# EasyEDA Pro project ProPrj_门禁卡管理系统_2024-12-31.epro

# Schematic Schematic1
Create Date: 2024-09-03; Page Name: P1; Project Name: 门禁卡管理系统; Schematic Name: Schematic1; Update Date: 2024-09-03; Company: 嘉立创EDA; Page Size: A4; Version: V1.0
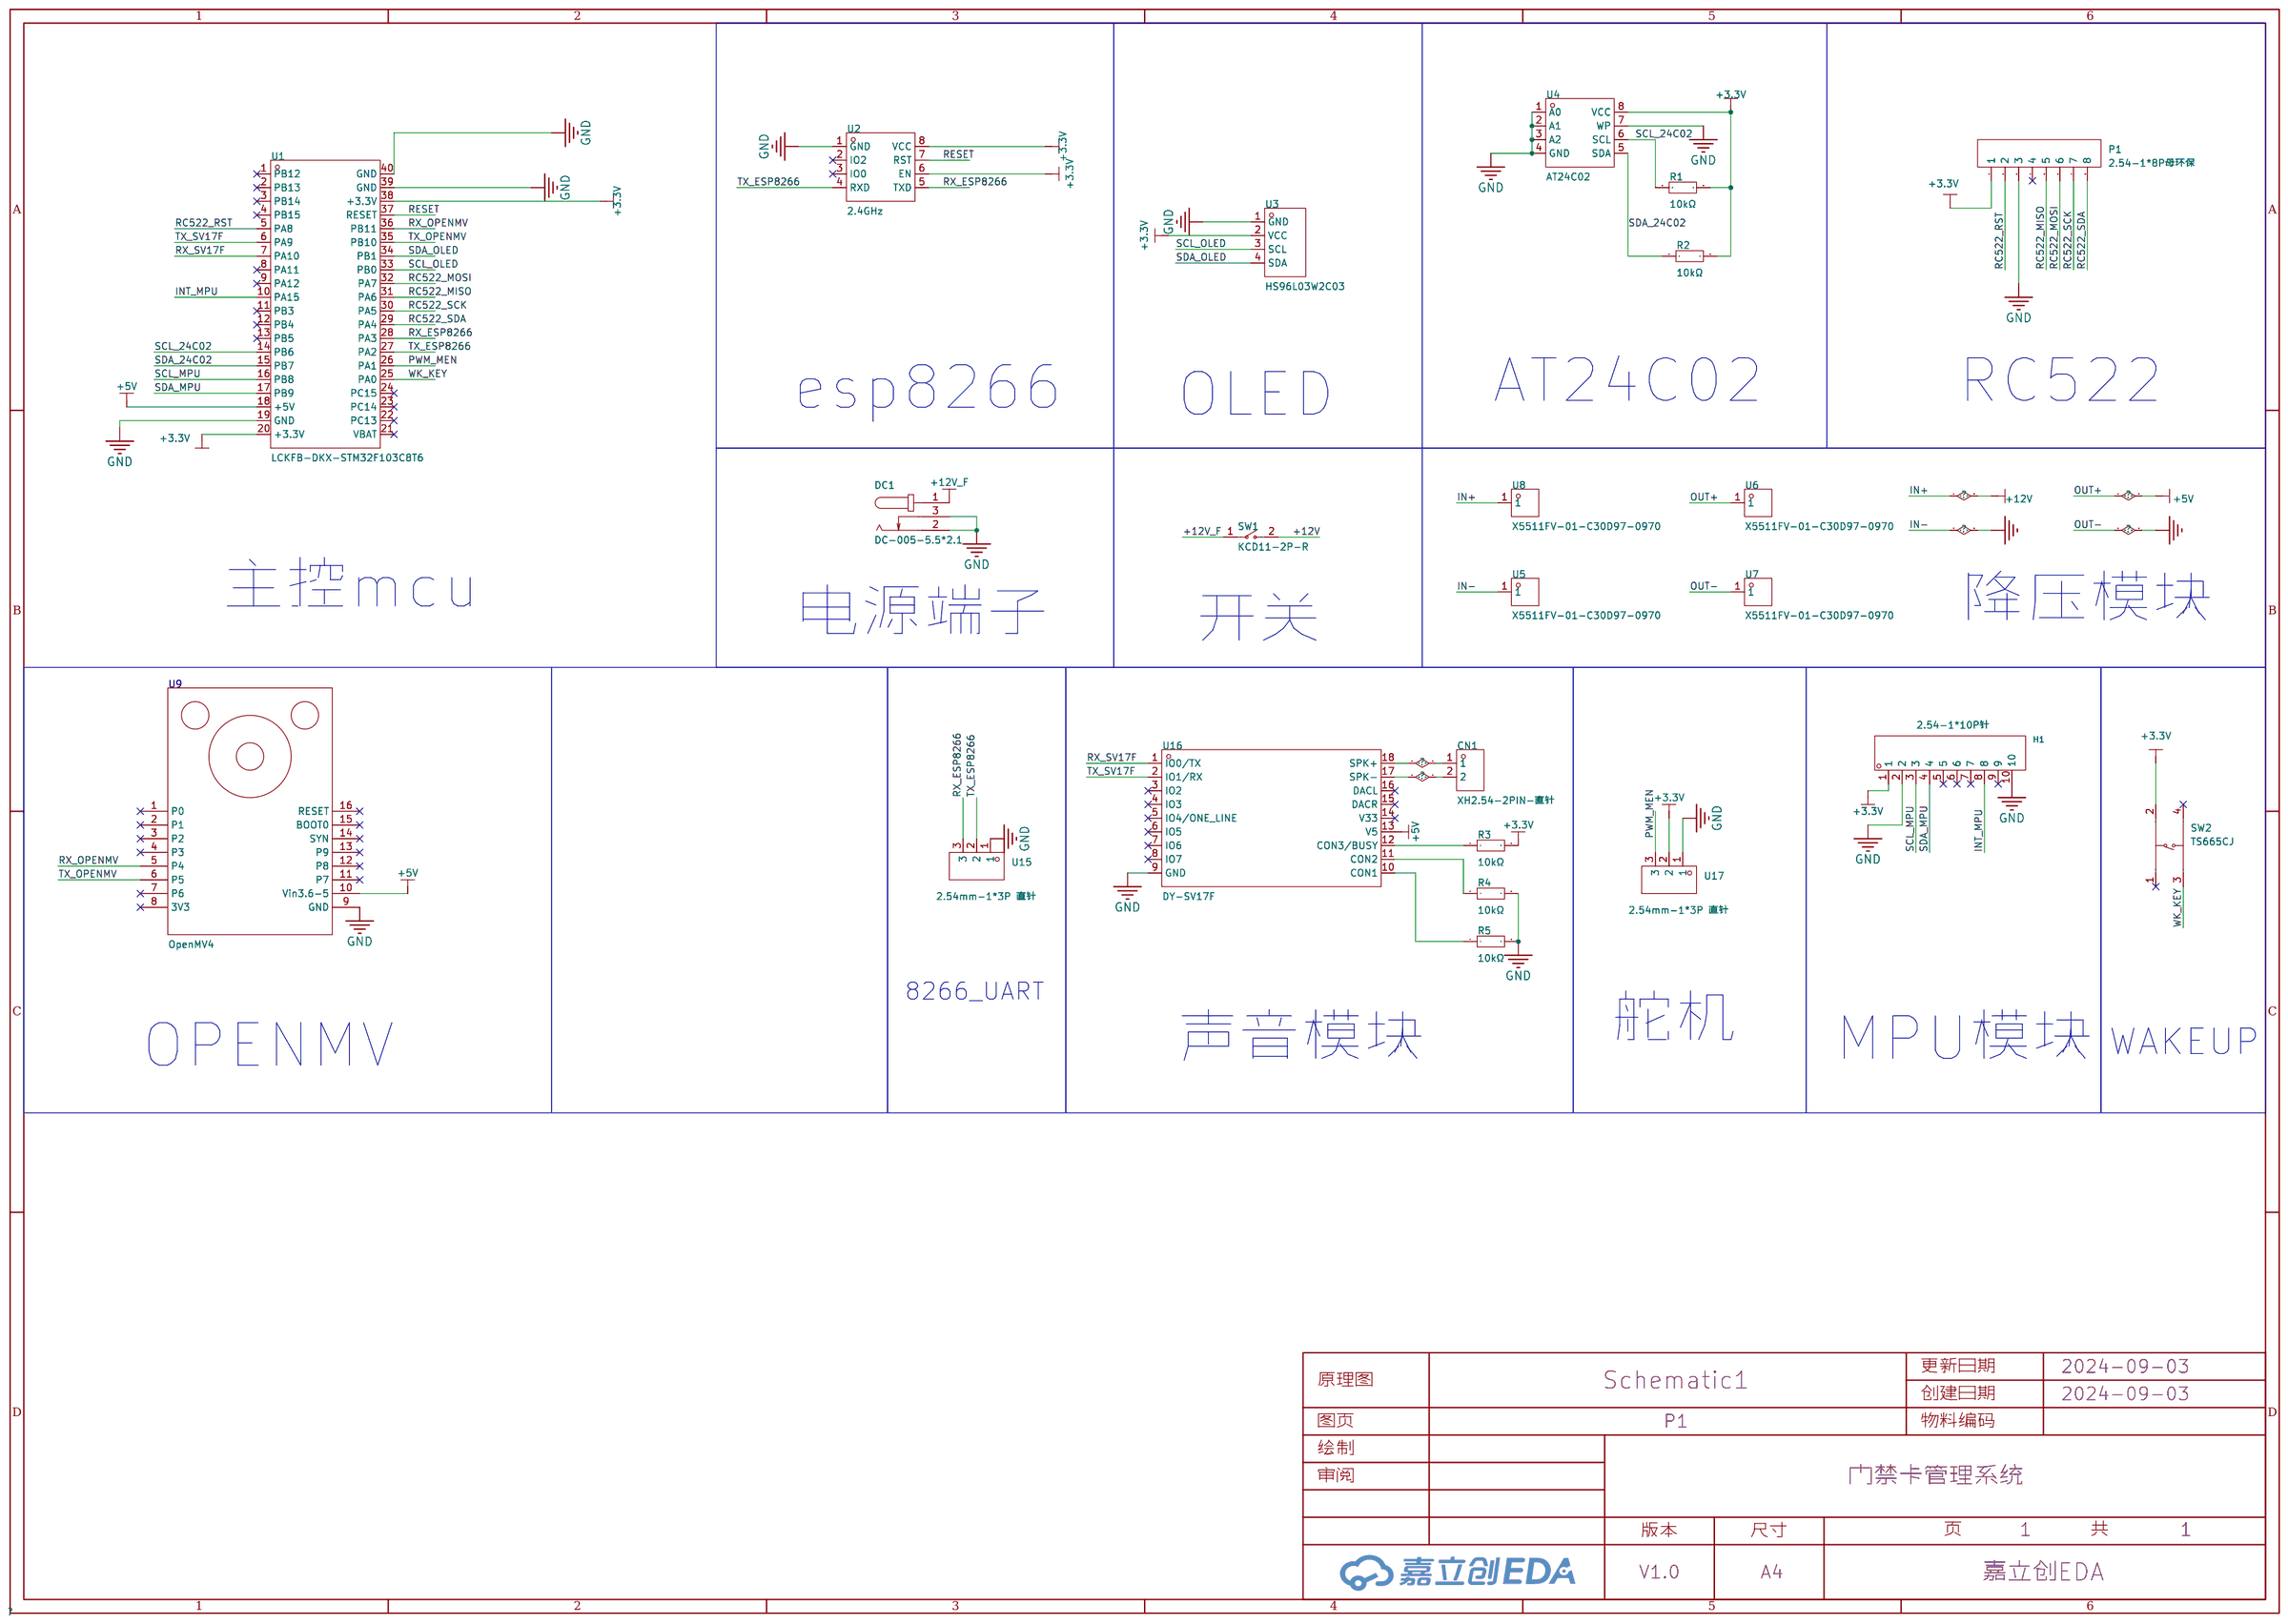
[diagram p0: schematic sheet]

## Parts
CN1  XH2.54-2PIN-直针  [CONN-TH_XH2.54-2P]
DC1  DC-005-5.5*2.1  [DC-IN-TH_DC-005-2]
H1  2.54-1*10P针  [HDR-TH_10P-P2.54-V-M-1]
P1  2.54-1*8P母环保  [HDR-TH_8P-P2.54-V-F-1]
R1  10kΩ  [R0805]
R2  10kΩ  [R0805]
R3  10kΩ  [R0805]
R4  10kΩ  [R0805]
R5  10kΩ  [R0805]
SW1  KCD11-2P-R  [SW-TH_2P-L15.0-W10.5-P5.00_KCD11-2P-R]
SW2  TS665CJ  [SW-TH_4P-L6.0-W6.0-P4.50-LS6.5]
U1  LCKFB-DKX-STM32F103C8T6  [CONN-TH_L53.3-W22.9_STM32F103C8T6-CARD]
U2  2.4GHz  [WIFIM-TH_8P-L24.7-W14.4-P2.54]
U3  HS96L03W2C03  [OLED-TH_L27.8-W27.2-P2.54_C9900033791]
U4  AT24C02  [SOP-8_L5.0-W4.0-P1.27-LS6.0-BL]
U5  X5511FV-01-C30D97-0970  [HDR-TH_1P-V-F-1]
U6  X5511FV-01-C30D97-0970  [HDR-TH_1P-V-F-1]
U7  X5511FV-01-C30D97-0970  [HDR-TH_1P-V-F-1]
U8  X5511FV-01-C30D97-0970  [HDR-TH_1P-V-F-1]
U9  OpenMV4  [OPENMV4]
U15  2.54mm-1*3P 直针  [HDR-TH_3P-P2.54-V-M-1]
U16  DY-SV17F  [COMM-SMD_DY-SV17F]
U17  2.54mm-1*3P 直针  [HDR-TH_3P-P2.54-V-M-1]

## Library data of the parts
CN1 = XH2.54-2PIN-直针: Supplier Part: C9900011425; Supplier Footprint: XH2.54-2PIN; JLCPCB Part Class: 扩展库; Supplier: LCSC
DC1 = DC-005-5.5*2.1: Supplier Part: C9900017044; Supplier Footprint: DC-005; JLCPCB Part Class: 扩展库; Supplier: LCSC
H1 = 2.54-1*10P针: 插针结构:1x10P;间距:2.54mm;行距:-;圆针/方针:方针;安装类型:直插;排数:单排;总PIN位数:10P;额定电流:3A;额定电压:-;配合针长度:-;塑高:-;端接针长度:-;触头材质:-;触头镀层:-;工作温度范围:-40℃~+105℃;颜色:黑色;; LCSC Part Name: 间距:2.54mm 1x10P 直插 方针; Supplier Part: C57369; Manufacturer: BOOMELE(博穆精密); Supplier Footprint: 插件,P=2.54mm; JLCPCB Part Class: 扩展库; Datasheet: https://atta.szlcsc.com/upload/public/pdf/source/20151109/1457707572883.pdf; Supplier: LCSC; Pin Structure: 1x10P; Pitch: 2.54mm; Circluar Pins/Square Pins: 方针; Mounting Type: 直插; Number of Rows: 单排; Number of Pins: 10P; Current Rating (Max): 3A; Operating Temperature Range: -40℃~+105℃; Color: 黑色
P1 = 2.54-1*8P母环保: 插孔结构:1x8P;间距:2.54mm;行距:-;安装类型:直插;排数:单排;总孔位数:8P;塑高:-;触头材质:-;触头镀层:-;; LCSC Part Name: 间距:2.54mm 1x8P 直插; Supplier Part: C27438; Manufacturer: BOOMELE(博穆精密); Supplier Footprint: 插件,P=2.54mm; JLCPCB Part Class: 扩展库; Datasheet: https://atta.szlcsc.com/upload/public/pdf/source/20231221/1CA800C6799ED97958773716FAA1BFFE.pdf; Supplier: LCSC; Holes Structure: 1x8P; Pitch: 2.54mm; Mounting Type: 直插; Number of Rows: 单排; Number of Holes: 8P
R1-R5 = 0805W8F1002T5E_C17414: 电阻类型:厚膜电阻;阻值:10kΩ;精度:±1%;功率:125mW;最大工作电压:150V;温度系数:±100ppm/℃;; LCSC Part Name: 10kΩ ±1% 125mW 厚膜电阻; Supplier Part: C17414; Manufacturer: UNI-ROYAL(厚声); Manufacturer Part: 0805W8F1002T5E; Supplier Footprint: 0805; JLCPCB Part Class: 基础库; Datasheet: https://atta.szlcsc.com/upload/public/pdf/source/20200306/C422600_1E6D84923E4A46A82E41ADD87F860B5C.pdf; Supplier: LCSC; Type: 厚膜电阻; Tolerance: ±1%; Power(Watts): 125mW; Overload Voltage (Max): 150V; Temperature Coefficient: ±100ppm/℃; Operating Temperature Range: -55℃~+155℃
SW1 = KCD11-2P-R: 带灯:无;引脚样式:焊片;额定电流:3A;额定电压(AC):250V;额定电压(DC):-;电路结构:单刀单掷;机械寿命:1万次;; LCSC Part Name: 10.5*15mm 两脚两档跷板开关 红钮; Supplier Part: C5884414; Manufacturer: SHOU HAN(首韩); Supplier Footprint: 插件; JLCPCB Part Class: 扩展库; Datasheet: https://atta.szlcsc.com/upload/public/pdf/source/20230506/CD06DFDE35C8048D34175BFF4AF6A2C2.pdf; Supplier: LCSC; Switch Length: 15mm; Switch Width: 10.5mm; Switch Height: 17.2mm; Actuator Type: 凹面弯曲; With Lamp: 无; Pin Style: 焊片; Actuator Color: 红色; Contact Current: 3A; Voltage Rating (AC): 250V; Circuit: 单刀单掷; Mechanical Life: 1万次; Operating Temperature: 0℃~+125℃; Actuator Identifier: - O
SW2 = TS665CJ: 触点电流:50mA;额定电压(DC):12V;电路结构:单刀单掷;安装方式:直插;带灯:-;机械寿命:-;; LCSC Part Name: 6*6*5mm 直插 轻触开关; Supplier Part: C393938; Manufacturer: SHOU HAN(首韩); Supplier Footprint: 插件; JLCPCB Part Class: 扩展库; Datasheet: https://atta.szlcsc.com/upload/public/pdf/source/20190521/C393938_BDABEAC600B4C55E200A80AA129B70BC.pdf; Supplier: LCSC; Contact Current: 50mA; Voltage Rating (DC): 12V; Circuit: 单刀单掷; Mounting Style: 直插; Actuator Style: 圆形按钮; Switch Length: 6mm; Switch Width: 6mm; Switch Height: 5mm
U1 = LCKFB-DKX-STM32F103C8T6: LCSC Part Name: 立创·地阔星-STM32F103C8T6开发板; Supplier Part: C22396880; Manufacturer: 立创开发板; Datasheet: https://atta.szlcsc.com/upload/public/pdf/source/20240801/7EEF69F7480DF7C6DA98696664D658D4.pdf; Supplier: LCSC
U2 = ESP-01S: 核心处理器:ESP8266芯片;频率:2.4GHz;天线形式:板载PCB天线;发射功率:16dBm;接收灵敏度:-90dBm;; LCSC Part Name: 完整的802.11b/g/nWi-FiSoC模块; Supplier Part: C503582; Manufacturer: Ai-Thinker(安信可); JLCPCB Part Class: 扩展库; Datasheet: https://atta.szlcsc.com/upload/public/pdf/source/20200407/C503582_1139AF8FB42E05635FA0089E1752A536.pdf; Supplier: LCSC; Core Processor: ESP8266芯片; Support Interface: GPIO；UART；PWM; Antenna Type: 板载PCB天线; Output Power: 16dBm; Operating Voltage: 3V~3.6V; Receive  Current: 56mA; Send  Current: 170mA; Sensitivity: -90dBm; Operating Temperature: -20℃~+70℃
U3 = HS96L03W2C03: 主控芯片:SSD1315;接口类型:I2C;尺寸(inch):0.96;像素分辨率:128x64;; LCSC Part Name: 0.96寸OLED显示屏窄白光IIC; Supplier Part: C5248080; Manufacturer: HS(汉昇); JLCPCB Part Class: 扩展库; Datasheet: https://atta.szlcsc.com/upload/public/pdf/source/20230627/763D01F79A90007632F098068C7C8AD9.pdf; Supplier: LCSC; Main Control Chip: SSD1315; Interface Type: I2C; Size: 0.96; Pixel Resolution: 128x64; Operating Temperature: -40℃~+70℃
U4 = AT24C02_C688857: Supplier Part: C688857; Manufacturer: IDCHIP(英锐芯); Supplier Footprint: SOP-8; JLCPCB Part Class: 扩展库; Datasheet: https://atta.szlcsc.com/upload/public/pdf/source/20200619/C688857_168265888F77B455D6D4136881F4BB15.pdf; Supplier: LCSC
U5-U8 = X5511FV-01-C30D97-0970: 插孔结构:1x1P;间距:2.54mm;行距:-;圆孔/方孔:圆孔;安装类型:直插;排数:单排;总孔位数:1P;额定电流:-;额定电压:-;插孔方向:顶部;塑高:3mm;触头材质:黄铜;触头镀层:金;工作温度范围:-40℃~+105℃;焊接温度(最大值):260℃;; LCSC Part Name: 间距:2.54mm 1x1P 直插; Supplier Part: C2883469; Manufacturer: XKB Connectivity(中国星坤); Supplier Footprint: 插件,P=2.54mm; JLCPCB Part Class: 扩展库; Datasheet: https://atta.szlcsc.com/upload/public/pdf/source/20211009/43EC1C49F931A7FEC57CD081BD1C4E7E.pdf; Supplier: LCSC; Holes Structure: 1x1P; Pitch: 2.54mm; Circular Hole / Square Hole: 圆孔; Mounting Type: 直插; Number of Rows: 单排; Number of Holes: 1P; Holes Direction: 顶部; Insulation Height: 3mm; Contact Material: 黄铜; Contact Plating: 金; Operating Temperature Range: -40℃~+105℃; Soldering Temperature(Max): 260℃
U9 = OpenMV: link: https://item.taobao.com/item.htm?spm=a1z10.1-c-s.w5001-14519673283.4.2a643071NDaCXxid=586827631220scene=taobao_shop
U15 U17 = 2.54mm-1*3P 直针: Supplier Part: C9900025313; Supplier Footprint: 2.54-180-3P; JLCPCB Part Class: 扩展库; Supplier: LCSC
U16 = DY-SV17F_C9900000256: Supplier Part: C9900000256; Supplier Footprint: SMD-18_23.0X26.0X2.54P; JLCPCB Part Class: 扩展库; Supplier: LCSC

## Nets
+3.3V: H1.1 P1.1 R1.2 R2.2 R3.2 SW2.2(B) U1.20(+3.3V) U1.38(+3.3V) U2.6(EN) U2.8(VCC) U3.2(VCC) U4.8(VCC) U17.2
+5V: U1.18(+5V) U6.1 U9.10(Vin3.6-5) U16.13(V5)
+12V: SW1.2 U8.1
+12V_F: DC1.1 SW1.1
GND: DC1.2 DC1.3 H1.2 H1.10 P1.3 R4.2 R5.2 U1.19(GND) U1.39(GND) U1.40(GND) U2.1(GND) U3.1(GND) U4.1(A0) U4.2(A1) U4.3(A2) U4.4(GND) U4.7(WP) U5.1 U7.1 U9.9(GND) U15.1 U16.9(GND) U17.1
INT_MPU: H1.8 U1.10(PA15)
PWM_MEN: U1.26(PA1) U17.3
RC522_MISO: P1.5 U1.31(PA6)
RC522_MOSI: P1.6 U1.32(PA7)
RC522_RST: P1.2 U1.5(PA8)
RC522_SCK: P1.7 U1.30(PA5)
RC522_SDA: P1.8 U1.29(PA4)
RESET: U1.37(RESET) U2.7(RST)
RX_ESP8266: U1.28(PA3) U2.5(TXD) U15.3
RX_OPENMV: U1.36(PB11) U9.5(P4)
RX_SV17F: U1.7(PA10) U16.1(IO0/TX)
SCL_24C02: R1.1 U1.14(PB6) U4.6(SCL)
SCL_MPU: H1.3 U1.16(PB8)
SCL_OLED: U1.33(PB0) U3.3(SCL)
SDA_24C02: R2.1 U1.15(PB7) U4.5(SDA)
SDA_MPU: H1.4 U1.17(PB9)
SDA_OLED: U1.34(PB1) U3.4(SDA)
TX_ESP8266: U1.27(PA2) U2.4(RXD) U15.2
TX_OPENMV: U1.35(PB10) U9.6(P5)
TX_SV17F: U1.6(PA9) U16.2(IO1/RX)
WK_KEY: SW2.3(C) U1.25(PA0)
$1N3071: R3.1 U16.12(CON3/BUSY)
$1N3110: R4.1 U16.11(CON2)
$1N3214: R5.1 U16.10(CON1)
$1N3367: CN1.1 U16.18(SPK+)
$1N3386: CN1.2 U16.17(SPK-)

Not connected (* = marked no-connect by the designer): H1 5* 6* 7* 9*; P1 4*; SW2 1(A)* 4(D)*; U1 1(PB12)* 2(PB13)* 3(PB14)* 4(PB15)* 8(PA11)* 9(PA12)* 11(PB3)* 12(PB4)* 13(PB5)* 21(VBAT)* 22(PC13)* 23(PC14)* 24(PC15)*; U2 2(IO2)* 3(IO0)*; U9 1(P0)* 2(P1)* 3(P2)* 4(P3)* 7(P6)* 8(3V3)* 11(P7)* 12(P8)* 13(P9)* 14(SYN)* 15(BOOT0)* 16(RESET)*; U16 3(IO2)* 4(IO3)* 5(IO4/ONE_LINE)* 6(IO5)* 7(IO6)* 8(IO7)* 14(V33)* 15(DACR)* 16(DACL)*

## Notes on the sheet
- esp8266
- OLED
- AT24C02
- RC522
- 主控mcu
- 降压模块
- 电源端子
- 开关
- 8266_UART
- 舵机
- 声音模块
- MPU模块
- WAKEUP
- OPENMV

# Board PCB1
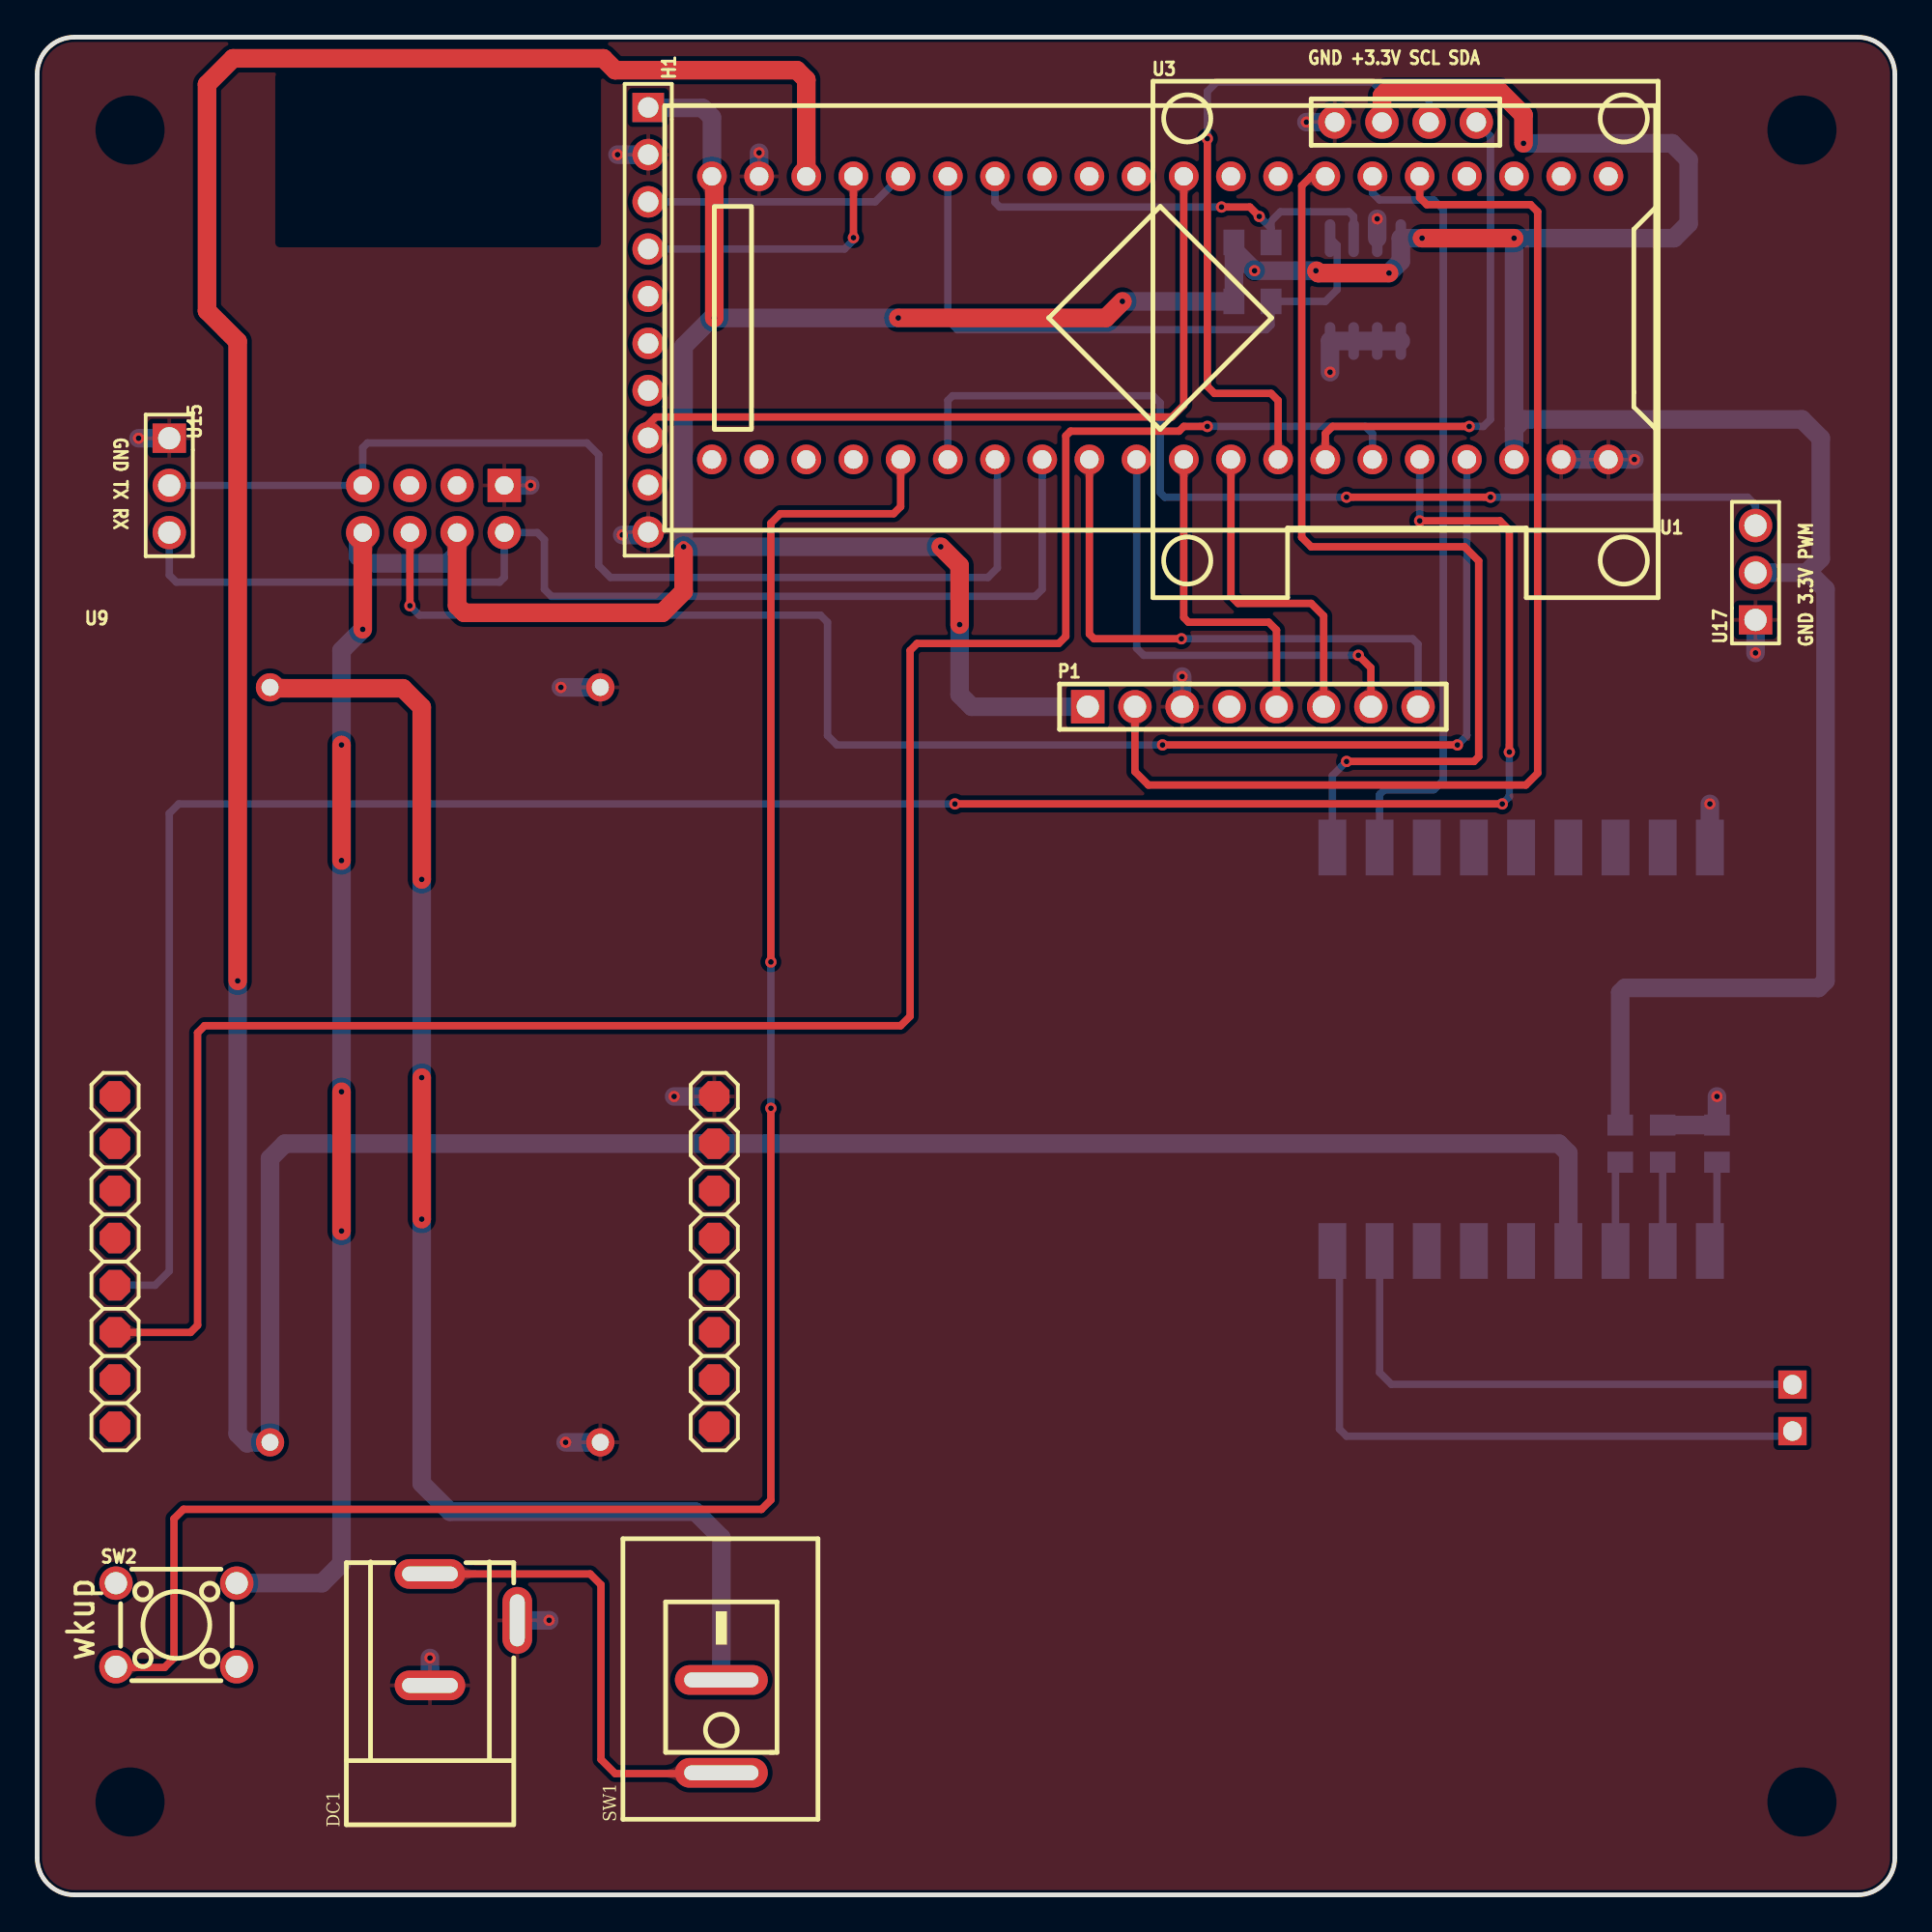
[diagram p1: board, top side]
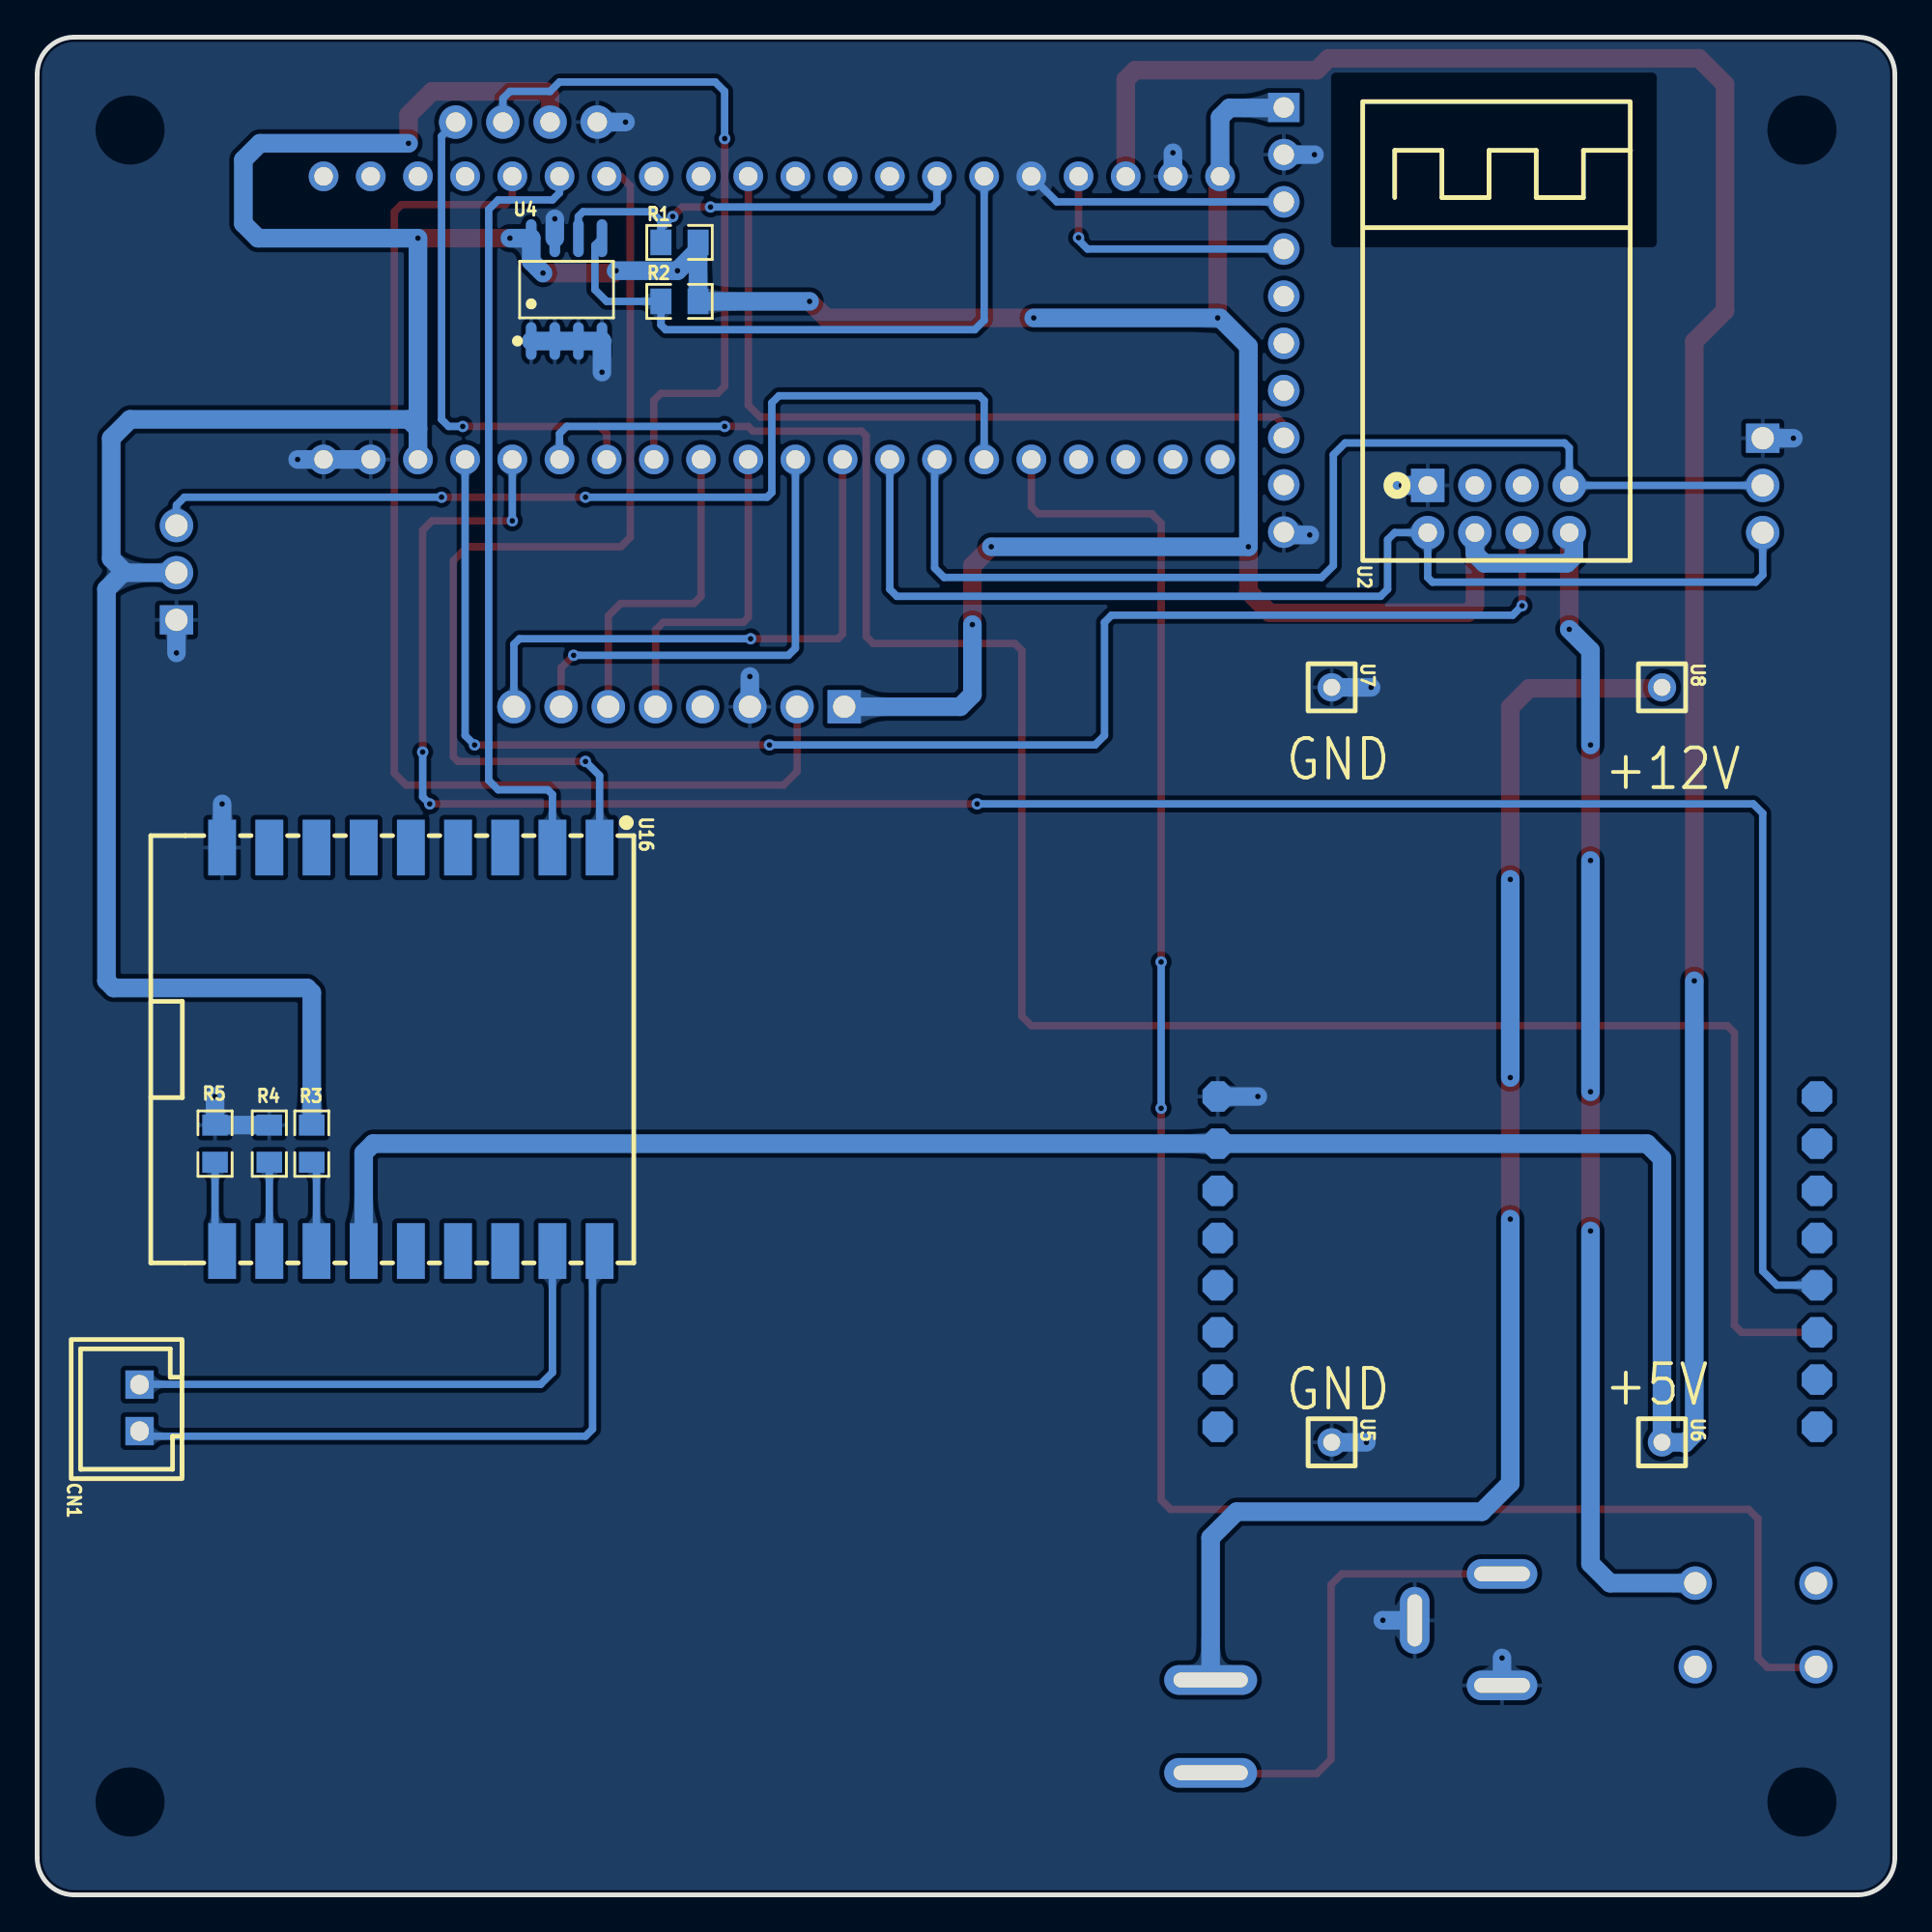
[diagram p2: board, bottom side, seen from below]

Outline 100 x 100 mm; copper layers: Top Layer, Bottom Layer. Coordinates in mm from the lower left corner of the outline.
Outline path: 0,98 0,2 arc(0.59,0.59) 2,0 98,0 arc(99.41,0.59) 100,2 100,98 arc(99.41,99.41) 98,100 2,100 arc(0.59,99.41) 0,98
Stack: Top Layer 0.035mm / Dielectric1 1.51mm FR4 er 4.5 / Bottom Layer 0.035mm

## Design rules (mm)
template: JLCPCB Capability(Two Layers Board)
spacing copperThickness1oz (default): track to track 0.102, other pairs 0.152 to 0.3
spacing copperThickness2oz: track to track 0.203, other pairs 0.152 to 0.3
track width copperThickness1oz (default): min 0.127, default 0.254, max 2.54
track width copperThickness2oz: min 0.203, default 0.254, max 2.54
differential pair differentialPair (default): width min 0.127, default 0.254, max 2.54; gap min 0.152, default 0.152
via viaSize (default): diameter min 0.5, default 0.61, max 10; hole min 0.3, default 0.305, max 6.3

## Placement (name value [footprint] x y rotation side)
CN1  XH2.54-2PIN-直针  [CONN-TH_XH2.54-2P]  94.49 26.21 90 bottom
DC1  DC-005-5.5*2.1  [DC-IN-TH_DC-005-2]  23.5 14.28 90 top
H1  2.54-1*10P针  [HDR-TH_10P-P2.54-V-M-1]  32.89 84.79 270 top
P1  2.54-1*8P母环保  [HDR-TH_8P-P2.54-V-F-1]  65.44 63.96 0 top
R1  10kΩ  [R0805]  65.42 88.95 180 bottom
R2  10kΩ  [R0805]  65.42 85.78 180 bottom
R3  10kΩ  [R0805]  85.22 40.44 90 bottom
R4  10kΩ  [R0805]  87.5 40.44 90 bottom
R5  10kΩ  [R0805]  90.42 40.44 90 bottom
SW1  KCD11-2P-R  [SW-TH_2P-L15.0-W10.5-P5.00_KCD11-2P-R]  36.83 9.07 90 top
SW2  TS665CJ  [SW-TH_4P-L6.0-W6.0-P4.50-LS6.5]  7.49 14.53 0 top
U1  LCKFB-DKX-STM32F103C8T6  [CONN-TH_L53.3-W22.9_STM32F103C8T6-CARD]  60.45 84.89 180 top
U2  2.4GHz  [WIFIM-TH_8P-L24.7-W14.4-P2.54]  21.34 74.6 90 bottom
U3  HS96L03W2C03  [OLED-TH_L27.8-W27.2-P2.54_C9900033791]  73.66 95.43 0 top
U4  AT24C02  [SOP-8_L5.0-W4.0-P1.27-LS6.0-BL]  71.5 86.41 180 bottom
U5  X5511FV-01-C30D97-0970  [HDR-TH_1P-V-F-1]  30.31 24.36 270 bottom
U6  X5511FV-01-C30D97-0970  [HDR-TH_1P-V-F-1]  12.53 24.36 270 bottom
U7  X5511FV-01-C30D97-0970  [HDR-TH_1P-V-F-1]  30.31 65 270 bottom
U8  X5511FV-01-C30D97-0970  [HDR-TH_1P-V-F-1]  12.53 65 270 bottom
U9  OpenMV4  [OPENMV4]  2.54 68.12 0 top
U15  2.54mm-1*3P 直针  [HDR-TH_3P-P2.54-V-M-1]  7.11 75.87 270 top
U16  DY-SV17F  [COMM-SMD_DY-SV17F]  79.88 45.52 270 bottom
U17  2.54mm-1*3P 直针  [HDR-TH_3P-P2.54-V-M-1]  92.5 71.17 90 top

## Footprints (pads in the part's own frame, mm; a bottom-side part is the same pattern mirrored in y, then rotated)
COMM-SMD_DY-SV17F
  rect 3x1.5 smd: 1(-10.86,10.16) 2(-10.86,7.62) 3(-10.86,5.08) 4(-10.86,2.54) 5(-10.86,0) 6(-10.86,-2.54) 7(-10.86,-5.08) 8(-10.86,-7.62) 9(-10.86,-10.16) 10(10.86,-10.16) 11(10.86,-7.62) 12(10.86,-5.08) 13(10.86,-2.54) 14(10.86,0) 15(10.86,2.54) 16(10.86,5.08) 17(10.86,7.62) 18(10.86,10.16)
CONN-TH_L53.3-W22.9_STM32F103C8T6-CARD
  round 1.6 hole 1: 1(-24.13,-7.62) 2(-21.59,-7.62) 3(-19.05,-7.62) 4(-16.51,-7.62) 5(-13.97,-7.62) 6(-11.43,-7.62) 7(-8.89,-7.62) 8(-6.35,-7.62) 9(-3.81,-7.62) 10(-1.27,-7.62) 11(1.27,-7.62) 12(3.81,-7.62) 13(6.35,-7.62) 14(8.89,-7.62) 15(11.43,-7.62) 16(13.97,-7.62) 17(16.51,-7.62) 18(19.05,-7.62) 19(21.59,-7.62) 20(24.13,-7.62) 21(24.13,7.62) 22(21.59,7.62) 23(19.05,7.62) 24(16.51,7.62) 25(13.97,7.62) 26(11.43,7.62) 27(8.89,7.62) 28(6.35,7.62) 29(3.81,7.62) 30(1.27,7.62) 31(-1.27,7.62) 32(-3.81,7.62) 33(-6.35,7.62) 34(-8.89,7.62) 35(-11.43,7.62) 36(-13.97,7.62) 37(-16.51,7.62) 38(-19.05,7.62) 39(-21.59,7.62) 40(-24.13,7.62)
CONN-TH_XH2.54-2P
  rect 1.524x1.524 hole 1.05x1: 1(-1.25,0) 2(1.25,0)
DC-IN-TH_DC-005-2
  oval 1.6x3.8 hole 0.8x3: 1(2.999,2.35) 2(-3,2.35)
  oval 3.6x1.6 hole 2.8x0.8: 3(0.5,-2.35)
HDR-TH_1P-V-F-1
  round 1.524 hole 0.914: 1(0,0)
HDR-TH_3P-P2.54-V-M-1
  rect 1.575x1.8 hole 1.2: 1(-2.54,0)
  round 1.8 hole 1.2: 2(0,0) 3(2.54,0)
HDR-TH_8P-P2.54-V-F-1
  rect 1.8x1.8 hole 1.2: 1(-8.89,0)
  round 1.8 hole 1.2: 2(-6.35,0) 3(-3.81,0) 4(-1.27,0) 5(1.27,0) 6(3.81,0) 7(6.35,0) 8(8.89,0)
HDR-TH_10P-P2.54-V-M-1
  rect 1.575x1.7 hole 1.1: 1(-11.43,0)
  round 1.7 hole 1.1: 2(-8.89,0) 3(-6.35,0) 4(-3.81,0) 5(-1.27,0) 6(1.27,0) 7(3.81,0) 8(6.35,0) 9(8.89,0) 10(11.43,0)
OLED-TH_L27.8-W27.2-P2.54_C9900033791
  round 1.8 hole 1.05: 1(-3.81,0) 2(-1.27,0) 3(1.27,0) 4(3.81,0)
OPENMV4
  custom 1.643x1.643 hole 1.021x1.016: 1(1.651,-25.146) 2(1.651,-27.686) 3(1.651,-30.226) 4(1.651,-32.766) 5(1.651,-35.306) 6(1.651,-37.846) 7(1.651,-40.386) 8(1.651,-42.926) 9(33.909,-25.146) 10(33.909,-27.686) 11(33.909,-30.226) 12(33.909,-32.766) 13(33.909,-35.306)
  custom 1.643x1.643 hole 1.016x1.021: 14(33.909,-37.846) 15(33.909,-40.386) 16(33.909,-42.926)
R0805
  rect 1.133x1.377 smd: 1(-1,0) 2(1,0)
SOP-8_L5.0-W4.0-P1.27-LS6.0-BL
  oval 0.574x2.035 smd: 1(-1.905,-2.768) 2(-0.635,-2.768) 3(0.635,-2.768) 4(1.905,-2.768) 5(1.905,2.768) 6(0.635,2.768) 7(-0.635,2.768) 8(-1.905,2.768)
SW-TH_2P-L15.0-W10.5-P5.00_KCD11-2P-R
  oval 1.6x5 hole 0.8x4: 1(-2.5,0) 2(2.5,0)
SW-TH_4P-L6.0-W6.0-P4.50-LS6.5
  round 1.8 hole 1.2: 1(-3.25,2.25) 2(3.25,2.25) 3(-3.25,-2.25) 4(3.25,-2.25)
WIFIM-TH_8P-L24.7-W14.4-P2.54
  rect 1.8x1.8 hole 1: 1(1.27,3.81)
  round 1.8 hole 1: 2(1.27,1.27) 3(1.27,-1.27) 4(1.27,-3.81) 5(-1.27,3.81) 6(-1.27,1.27) 7(-1.27,-1.27) 8(-1.27,-3.81)

## Nets
As in the schematic.

Pads without a net: H1 5 6 7 9; P1 4; SW2 1 4; U1 1 2 3 4 8 9 11 12 13 21 22 23 24; U2 2 3; U9 1 2 3 4 7 8 11 12 13 14 15 16; U16 3 4 5 6 7 8 14 15 16

## Via types
v1: diameter 0.61, hole 0.305, Top Layer to Bottom Layer, 59 vias

## Routing (per net, layer and track width the routed paths; a pad name or vN(x,y) marks a point on that pad's centre or on a via; arc(x,y) is an arc through that point)
+3.3V: length 308.5
  Top Layer w1: U3.2 72.39,96.84 72.63,97.08 78.74,97.08 80.01,95.81 v1(80.01,94.28) ; 68.87,87.43 68.87,87.39 68.96,87.3 v1(72.77,87.3) ; v1(36.45,84.89) 36.45,92.38 U1.20 ; v1(58.42,85.78) 57.53,84.89 v1(46.35,84.89) ; v1(16.38,55.68) v1(16.38,61.9) ; v1(16.38,35.74) v1(16.38,43.23) ; 34.8,72.31 34.8,70.16 33.66,69.01 22.99,69.01 22.61,69.39 U2.6 ; v1(17.53,68.12) U2.8 ; v1(49.66,68.38) 49.66,71.55 v1(48.64,72.57) ; v1(74.55,89.18) v1(79.5,89.18)
  Bottom Layer w1: R3.2 85.22,48.56 85.47,48.82 95.88,48.82 96.27,49.2 96.27,70.28 95.38,71.17 95.25,71.17 ; v1(80.01,94.28) 88.01,94.28 88.9,93.4 88.9,89.97 88.11,89.18 v1(79.5,89.18) 79.5,78.92 ; U17.2 95.25,71.17 ; 95.25,71.17 96.01,71.93 96.01,78.41 95,79.43 80.01,79.43 79.5,78.92 ; v1(49.66,68.38) 49.66,64.61 50.31,63.96 P1.1 ; v1(16.38,35.74) 16.38,17.83 15.33,16.78 SW2.2 ; v1(16.38,61.9) 16.38,66.98 v1(17.53,68.12) ; v1(72.77,87.3) 73.41,87.94 U4.8 v1(74.55,89.18) ; 64.42,88.54 R2.2 v1(58.42,85.78) ; 64.42,88.54 R1.2 ; 64.42,88.54 v1(65.53,87.43) v1(68.83,87.43) ; v1(36.45,84.89) v1(46.35,84.89) ; v1(48.64,72.57) v1(34.8,72.57) 34.8,83.36 36.32,84.89 ; v1(16.38,43.23) v1(16.38,55.68) ; 79.5,78.92 U1.38 ; U2.8 17.27,73.08 17.27,72.06 17.65,71.68 22.1,71.68 22.61,72.19 U2.6 ; U1.20 36.32,95.68 35.81,96.19 32.92,96.19 H1.1
+5V: length 204.8
  Top Layer w1: U1.18 41.4,97.71 40.89,98.22 31.12,98.22 30.48,98.86 10.54,98.86 9.14,97.46 9.14,85.27 10.8,83.62 v1(10.8,49.2)
  Bottom Layer w1: v1(10.8,49.2) 10.8,24.82 11.3,24.31 11.35,24.36 U6.1 12.53,39.64 13.33,40.44 81.91,40.44 82.42,39.93 U16.13
+12V: length 75.4
  Top Layer w1: U8.1 12.59,64.95 19.69,64.95 20.7,63.93 v1(20.7,54.66) ; v1(20.7,36.37) v1(20.7,43.99)
  Bottom Layer w1: SW1.2 36.83,19.23 35.43,20.62 22.22,20.62 20.7,22.15 v1(20.7,36.37) ; v1(20.7,43.99) v1(20.7,54.66)
+12V_F: length 25.7
  Top Layer w0.4: 21.14,17.27 29.77,17.27 30.35,16.69 30.35,7.29 31.12,6.53 36.79,6.53 SW1.1
GND: length 39
  Bottom Layer w1: U15.1 v1(5.46,78.41) ; v1(69.6,81.97) U4.4 U4.3 U4.2 U4.1 ; v1(90.42,42.98) R5.2 R4.2 ; U16.9 v1(90.04,58.72) ; v1(85.98,77.27) U1.40 U1.39 ; DC1.3 27.55,14.78 v1(27.56,14.78) ; U4.7 v1(72.14,90.22) ; U9.9 v1(34.29,42.98) ; H1.10 32.74,73.2 v1(31.5,73.2) ; U5.1 v1(28.45,24.36) ; U17.1 v1(92.5,66.85) ; U2.1 26.54,75.87 ; U7.1 v1(28.19,65) ; U1.19 v1(38.86,93.78) ; U3.1 v1(68.33,95.43) ; H1.2 v1(31.24,93.68) ; 21.14,11.28 v1(21.14,12.75) ; P1.3 v1(61.63,65.58)
  vias: v1(26.56,75.87)
INT_MPU: length 42.3
  Top Layer w0.4: H1.8 32.89,79.15 33.29,79.55 61.09,79.55 61.72,80.19 U1.10
PWM_MEN: length 53.1
  Top Layer w0.4: v1(78.23,75.23) v1(70.49,75.23)
  Bottom Layer w0.4: v1(70.49,75.23) 60.71,75.23 60.45,75.49 60.45,80.31 60.07,80.7 49.28,80.7 49.02,80.44 U1.26 ; v1(78.23,75.23) 92.07,75.23 92.5,74.81 U17.3
RC522_MISO: length 17.9
  Top Layer w0.4: P1.5 66.72,68.08 66.29,68.5 61.98,68.5 61.72,68.76 U1.31
RC522_MOSI: length 17.7
  Top Layer w0.4: P1.6 69.25,68.84 68.58,69.52 64.64,69.52 64.26,69.9 U1.32
RC522_RST: length 63.8
  Top Layer w0.4: U1.5 74.42,91.36 74.8,90.98 80.39,90.98 80.77,90.6 80.77,60.38 80.14,59.74 59.82,59.74 59.09,60.46 P1.2
RC522_SCK: length 25.3
  Top Layer w0.4: v1(71.12,66.73) 71.79,66.05 P1.7
  Bottom Layer w0.4: v1(71.12,66.73) 59.56,66.73 59.18,67.11 U1.30
RC522_SDA: length 30.7
  Top Layer w0.4: U1.29 56.64,67.87 56.9,67.61 v1(61.59,67.61)
  Bottom Layer w0.4: v1(61.59,67.61) 74.04,67.61 74.34,67.32 74.34,63.96
RESET: length 82.6
  Top Layer w0.4: v1(20.07,69.39) U2.7 ; v1(76.45,61.9) v1(60.58,61.9)
  Bottom Layer w0.4: U1.37 76.96,62.41 v1(76.45,61.9) ; v1(60.58,61.9) 43.05,61.9 42.54,62.41 42.54,68.5 42.16,68.89 20.57,68.89 v1(20.07,69.39)
RX_ESP8266: length 62.1
  Bottom Layer w0.4: U1.28 54.1,70.28 53.72,69.9 27.69,69.9 27.31,70.28 27.31,72.95 26.92,73.33 U2.5 25.15,70.92 24.89,70.66 7.49,70.66 7.11,71.04 U15.3
RX_OPENMV: length 123.1
  Top Layer w0.4: v1(79.25,61.52) 79.25,73.46 78.74,73.97 v1(74.42,73.97) ; v1(78.87,58.72) v1(49.4,58.72)
  Bottom Layer w0.4: U9.5 6.35,32.82 7.11,33.58 7.11,58.22 7.62,58.72 v1(49.4,58.72) ; v1(79.25,61.52) 79.25,59.11 v1(78.87,58.72) ; v1(74.42,73.97) U1.36
RX_SV17F: length 53.2
  Top Layer w0.4: U1.7 68.58,92.51 68.07,92 68.07,73.08 68.58,72.57 76.84,72.57 77.6,71.81 77.6,61.27 77.34,61.01 v1(70.49,61.01)
  Bottom Layer w0.4: v1(70.49,61.01) 69.72,60.25 U16.1
SCL_24C02: length 23.9
  Top Layer w0.4: v1(65.79,90.35) 65.28,90.86 v1(63.75,90.86)
  Bottom Layer w0.4: 66.42,89.71 66.42,90.09 66.93,90.6 70.61,90.6 70.87,90.35 U4.6 ; 66.42,89.71 R1.1 ; 66.42,89.71 v1(65.79,90.35) ; v1(63.75,90.86) 51.82,90.86 51.56,91.11 U1.14
SCL_MPU: length 14.2
  Bottom Layer w0.4: U1.16 45.11,91.14 H1.3
SCL_OLED: length 36.5
  Top Layer w0.4: v1(62.99,94.54) 62.99,81.2 63.37,80.82 66.42,80.82 66.8,80.44 U1.33
  Bottom Layer w0.4: v1(62.99,94.54) 62.99,97.08 63.5,97.59 71.88,97.59 72.39,97.08 74.55,97.08 74.93,96.7 74.93,95.93
SDA_24C02: length 33.5
  Bottom Layer w0.4: U1.15 49.02,84.76 49.53,84.25 66.17,84.25 66.42,84.51 R2.1 69.34,85.78 69.98,86.41 69.98,88.8 U4.5
SDA_MPU: length 14.6
  Top Layer w0.4: v1(43.94,89.2) U1.17
  Bottom Layer w0.4: 43.94,89.08 43.46,88.6 H1.4
SDA_OLED: length 26.9
  Top Layer w0.4: U1.34 69.34,78.66 69.72,79.05 v1(77.09,79.05)
  Bottom Layer w0.4: v1(77.09,79.05) 77.85,79.05 78.23,79.43 78.23,94.67 U3.4
TX_ESP8266: length 59.3
  Bottom Layer w0.4: U1.27 51.69,77.14 51.69,71.42 51.18,70.92 30.86,70.92 30.23,71.55 30.23,77.52 29.59,78.16 17.78,78.16 17.53,77.9 U2.4 U15.2
TX_OPENMV: length 116.5
  Top Layer w0.4: 4.19,30.28 8.25,30.28 8.64,30.66 8.64,46.41 9.02,46.79 46.48,46.79 46.99,47.3 46.99,66.98 47.37,67.36 54.99,67.36 55.37,67.74 55.37,78.54 55.63,78.79 61.47,78.79 61.72,79.05 v1(62.99,79.05)
  Bottom Layer w0.4: v1(62.99,79.05) 71.49,79.05 71.88,78.66 U1.35
TX_SV17F: length 42.4
  Bottom Layer w0.4: U16.2 72.26,59.23 72.52,59.49 75.18,59.49 75.69,60 75.69,90.73 75.18,91.24 72.26,91.24 71.88,91.62 U1.6
WK_KEY: length 105.9
  Top Layer w0.4: v1(39.5,50.22) 39.5,73.84 40,74.35 46.1,74.35 46.48,74.73 U1.25 ; v1(39.5,42.34) 39.5,21.26 38.99,20.75 7.87,20.75 7.37,20.24 7.37,12.75 6.86,12.24 4.28,12.24 SW2.3
  Bottom Layer w0.4: v1(39.5,50.22) v1(39.5,42.34)
$1N3071: length 4.9
  Bottom Layer w0.4: U16.12 84.96,39.18 R3.1
$1N3110: length 4.8
  Bottom Layer w0.4: U16.11 R4.1
$1N3214: length 4.9
  Bottom Layer w0.4: R5.1 90.42,35.04 U16.10
$1N3367: length 34.4
  Bottom Layer w0.4: U16.18 70.1,34.28 70.1,25.07 70.49,24.69 94.21,24.69 CN1.1
$1N3386: length 29
  Bottom Layer w0.4: CN1.2 94.47,27.48 72.9,27.48 72.26,28.12 U16.17

## Copper pours and planes (outline as drawn; the poured copper is in the pictures)
GND on Top Layer: -8.51,105.08 117.47,105.08 117.47,-14.43 -8.51,-14.43
GND on Bottom Layer: -5.33,104.44 108.33,104.44 108.33,-13.16 -5.33,-13.16

Small or netless copper shapes (teardrops, artwork), in the pictures only: 46 on Top Layer, 114 on Bottom Layer

## Text on the board
Bottom Silkscreen Layer: +12V | +5V | GND
Top Silkscreen Layer: GND +3.3V SCL SDA | GND 3.3V PWM | GND TX RX | wkup
